# EAGLE design W964 (EAGLE 6.6.0)
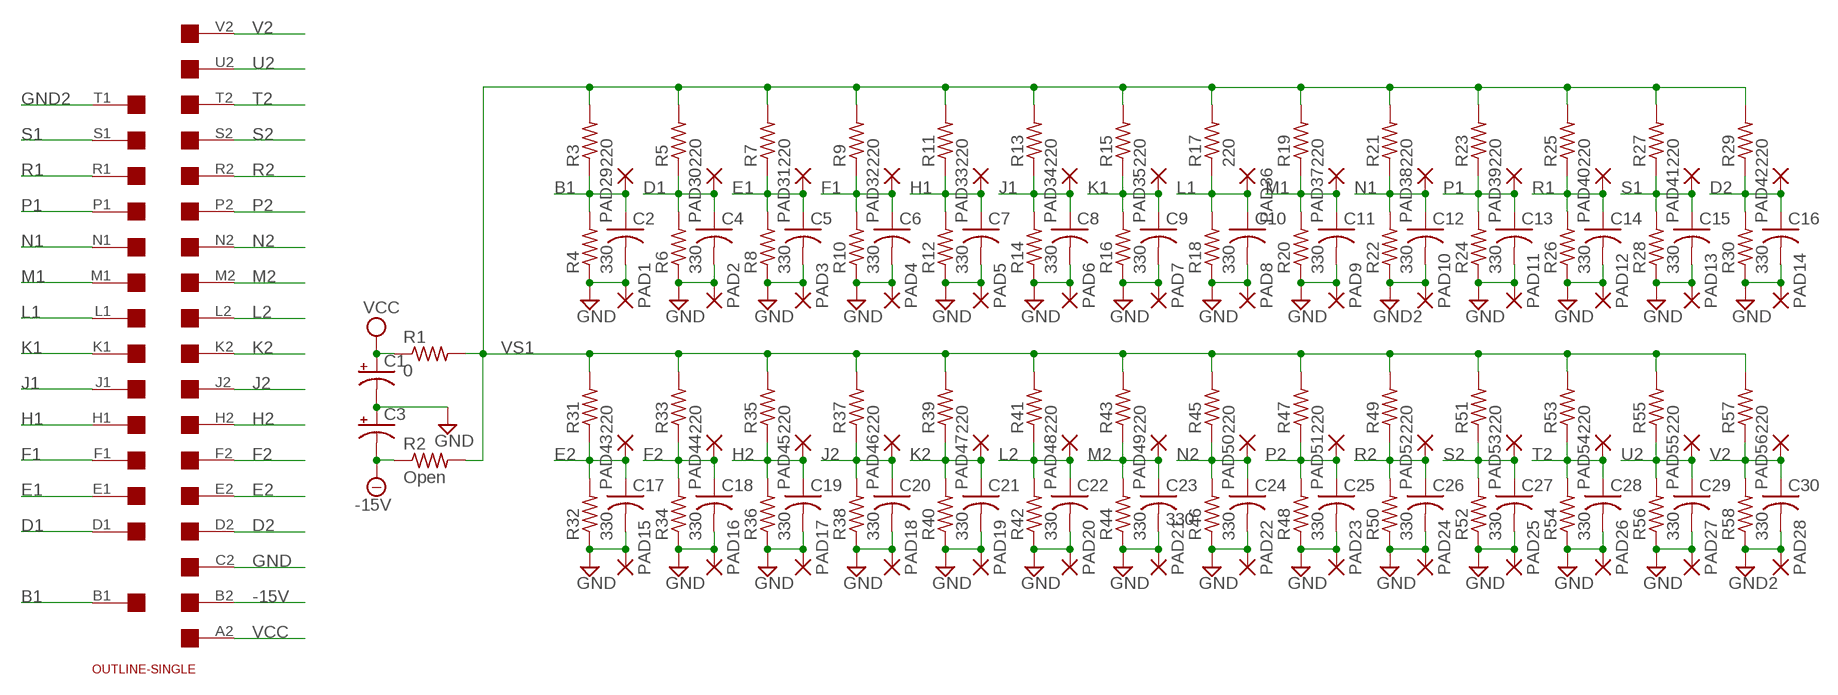
[diagram p0: schematic, sheet 1]

## Parts
C1  CPOL-USE22-6AXIAL  [E22-6]
C2  C-US050-025X075  [C050-025X075]
C3  CPOL-USE22-6AXIAL  [E22-6]
C4  C-US050-025X075  [C050-025X075]
C5  C-US050-025X075  [C050-025X075]
C6  C-US050-025X075  [C050-025X075]
C7  C-US050-025X075  [C050-025X075]
C8  C-US050-025X075  [C050-025X075]
C9  C-US050-025X075  [C050-025X075]
C10  C-US050-025X075  [C050-025X075]
C11  C-US050-025X075  [C050-025X075]
C12  C-US050-025X075  [C050-025X075]
C13  C-US050-025X075  [C050-025X075]
C14  C-US050-025X075  [C050-025X075]
C15  C-US050-025X075  [C050-025X075]
C16  C-US050-025X075  [C050-025X075]
C17  C-US050-025X075  [C050-025X075]
C18  C-US050-025X075  [C050-025X075]
C19  C-US050-025X075  [C050-025X075]
C20  C-US050-025X075  [C050-025X075]
C21  C-US050-025X075  [C050-025X075]
C22  C-US050-025X075  [C050-025X075]
C23  330  C-US050-025X075  [C050-025X075]
C24  C-US050-025X075  [C050-025X075]
C25  C-US050-025X075  [C050-025X075]
C26  C-US050-025X075  [C050-025X075]
C27  C-US050-025X075  [C050-025X075]
C28  C-US050-025X075  [C050-025X075]
C29  C-US050-025X075  [C050-025X075]
C30  C-US050-025X075  [C050-025X075]
PAD1  1,6/0,9  [1,6/0,9]
PAD2  1,6/0,9  [1,6/0,9]
PAD3  1,6/0,9  [1,6/0,9]
PAD4  1,6/0,9  [1,6/0,9]
PAD5  1,6/0,9  [1,6/0,9]
PAD6  1,6/0,9  [1,6/0,9]
PAD7  1,6/0,9  [1,6/0,9]
PAD8  1,6/0,9  [1,6/0,9]
PAD9  1,6/0,9  [1,6/0,9]
PAD10  1,6/0,9  [1,6/0,9]
PAD11  1,6/0,9  [1,6/0,9]
PAD12  1,6/0,9  [1,6/0,9]
PAD13  1,6/0,9  [1,6/0,9]
PAD14  1,6/0,9  [1,6/0,9]
PAD15  1,6/0,9  [1,6/0,9]
PAD16  1,6/0,9  [1,6/0,9]
PAD17  1,6/0,9  [1,6/0,9]
PAD18  1,6/0,9  [1,6/0,9]
PAD19  1,6/0,9  [1,6/0,9]
PAD20  1,6/0,9  [1,6/0,9]
PAD21  1,6/0,9  [1,6/0,9]
PAD22  1,6/0,9  [1,6/0,9]
PAD23  1,6/0,9  [1,6/0,9]
PAD24  1,6/0,9  [1,6/0,9]
PAD25  1,6/0,9  [1,6/0,9]
PAD26  1,6/0,9  [1,6/0,9]
PAD27  1,6/0,9  [1,6/0,9]
PAD28  1,6/0,9  [1,6/0,9]
PAD29  1,6/0,9  [1,6/0,9]
PAD30  1,6/0,9  [1,6/0,9]
PAD31  1,6/0,9  [1,6/0,9]
PAD32  1,6/0,9  [1,6/0,9]
PAD33  1,6/0,9  [1,6/0,9]
PAD34  1,6/0,9  [1,6/0,9]
PAD35  1,6/0,9  [1,6/0,9]
PAD36  1,6/0,9  [1,6/0,9]
PAD37  1,6/0,9  [1,6/0,9]
PAD38  1,6/0,9  [1,6/0,9]
PAD39  1,6/0,9  [1,6/0,9]
PAD40  1,6/0,9  [1,6/0,9]
PAD41  1,6/0,9  [1,6/0,9]
PAD42  1,6/0,9  [1,6/0,9]
PAD43  1,6/0,9  [1,6/0,9]
PAD44  1,6/0,9  [1,6/0,9]
PAD45  1,6/0,9  [1,6/0,9]
PAD46  1,6/0,9  [1,6/0,9]
PAD47  1,6/0,9  [1,6/0,9]
PAD48  1,6/0,9  [1,6/0,9]
PAD49  1,6/0,9  [1,6/0,9]
PAD50  1,6/0,9  [1,6/0,9]
PAD51  1,6/0,9  [1,6/0,9]
PAD52  1,6/0,9  [1,6/0,9]
PAD53  1,6/0,9  [1,6/0,9]
PAD54  1,6/0,9  [1,6/0,9]
PAD55  1,6/0,9  [1,6/0,9]
PAD56  1,6/0,9  [1,6/0,9]
R1  0  R-US_0207/10  [0207/10]
R2  Open  R-US_0207/10  [0207/10]
R3  220  R-US_0207/10  [0207/10]
R4  330  R-US_0207/10  [0207/10]
R5  220  R-US_0207/10  [0207/10]
R6  330  R-US_0207/10  [0207/10]
R7  220  R-US_0207/10  [0207/10]
R8  330  R-US_0207/10  [0207/10]
R9  220  R-US_0207/10  [0207/10]
R10  330  R-US_0207/10  [0207/10]
R11  220  R-US_0207/10  [0207/10]
R12  330  R-US_0207/10  [0207/10]
R13  220  R-US_0207/10  [0207/10]
R14  330  R-US_0207/10  [0207/10]
R15  220  R-US_0207/10  [0207/10]
R16  330  R-US_0207/10  [0207/10]
R17  220  R-US_0207/10  [0207/10]
R18  330  R-US_0207/10  [0207/10]
R19  220  R-US_0207/10  [0207/10]
R20  330  R-US_0207/10  [0207/10]
R21  220  R-US_0207/10  [0207/10]
R22  330  R-US_0207/10  [0207/10]
R23  220  R-US_0207/10  [0207/10]
R24  330  R-US_0207/10  [0207/10]
R25  220  R-US_0207/10  [0207/10]
R26  330  R-US_0207/10  [0207/10]
R27  220  R-US_0207/10  [0207/10]
R28  330  R-US_0207/10  [0207/10]
R29  220  R-US_0207/10  [0207/10]
R30  330  R-US_0207/10  [0207/10]
R31  220  R-US_0207/10  [0207/10]
R32  330  R-US_0207/10  [0207/10]
R33  220  R-US_0207/10  [0207/10]
R34  330  R-US_0207/10  [0207/10]
R35  220  R-US_0207/10  [0207/10]
R36  330  R-US_0207/10  [0207/10]
R37  220  R-US_0207/10  [0207/10]
R38  330  R-US_0207/10  [0207/10]
R39  220  R-US_0207/10  [0207/10]
R40  330  R-US_0207/10  [0207/10]
R41  220  R-US_0207/10  [0207/10]
R42  330  R-US_0207/10  [0207/10]
R43  220  R-US_0207/10  [0207/10]
R44  330  R-US_0207/10  [0207/10]
R45  220  R-US_0207/10  [0207/10]
R46  330  R-US_0207/10  [0207/10]
R47  220  R-US_0207/10  [0207/10]
R48  330  R-US_0207/10  [0207/10]
R49  220  R-US_0207/10  [0207/10]
R50  330  R-US_0207/10  [0207/10]
R51  220  R-US_0207/10  [0207/10]
R52  330  R-US_0207/10  [0207/10]
R53  220  R-US_0207/10  [0207/10]
R54  330  R-US_0207/10  [0207/10]
R55  220  R-US_0207/10  [0207/10]
R56  330  R-US_0207/10  [0207/10]
R57  220  R-US_0207/10  [0207/10]
R58  330  R-US_0207/10  [0207/10]
U$1  EDGE-2CONNECTOR  [EDGE-CON2]
U$2  OUTLINE-SINGLE  [SINGLE]

## Nets
-15V [power]: C3.- R2.1 U$1.B2
B1: C2.1 PAD29.1(P) R3.1 R4.2 U$1.B1
D1: C4.1 PAD30.1(P) R5.1 R6.2 U$1.D1
D2: C16.1 PAD42.1(P) R29.1 R30.2 U$1.D2
E1: C5.1 PAD31.1(P) R7.1 R8.2 U$1.E1
E2: C17.1 PAD43.1(P) R31.1 R32.2 U$1.E2
F1: C6.1 PAD32.1(P) R9.1 R10.2 U$1.F1
F2: C18.1 PAD44.1(P) R33.1 R34.2 U$1.F2
GND [power]: C1.- C2.2 C3.+ C4.2 C5.2 C6.2 C7.2 C8.2 C9.2 C10.2 C11.2 C13.2 C14.2 C15.2 C16.2 C17.2 C18.2 C19.2 C20.2 C21.2 C22.2 C23.2 C24.2 C25.2 C26.2 C27.2 C28.2 C29.2 PAD1.1(P) PAD2.1(P) PAD3.1(P) PAD4.1(P) PAD5.1(P) PAD6.1(P) PAD7.1(P) PAD8.1(P) PAD9.1(P) PAD11.1(P) PAD12.1(P) PAD13.1(P) PAD14.1(P) PAD15.1(P) PAD16.1(P) PAD17.1(P) PAD18.1(P) PAD19.1(P) PAD20.1(P) PAD21.1(P) PAD22.1(P) PAD23.1(P) PAD24.1(P) PAD25.1(P) PAD26.1(P) PAD27.1(P) R4.1 R6.1 R8.1 R10.1 R12.1 R14.1 R16.1 R18.1 R20.1 R24.1 R26.1 R28.1 R30.1 R32.1 R34.1 R36.1 R38.1 R40.1 R42.1 R44.1 R46.1 R48.1 R50.1 R52.1 R54.1 R56.1 U$1.C2
GND2 [power]: C12.2 C30.2 PAD10.1(P) PAD28.1(P) R22.1 R58.1 U$1.T1
H1: C7.1 PAD33.1(P) R11.1 R12.2 U$1.H1
H2: C19.1 PAD45.1(P) R35.1 R36.2 U$1.H2
J1: C8.1 PAD34.1(P) R13.1 R14.2 U$1.J1
J2: C20.1 PAD46.1(P) R37.1 R38.2 U$1.J2
K1: C9.1 PAD35.1(P) R15.1 R16.2 U$1.K1
K2: C21.1 PAD47.1(P) R39.1 R40.2 U$1.K2
L1: C10.1 PAD36.1(P) R17.1 R18.2 U$1.L1
L2: C22.1 PAD48.1(P) R41.1 R42.2 U$1.L2
M1: C11.1 PAD37.1(P) R19.1 R20.2 U$1.M1
M2: C23.1 PAD49.1(P) R43.1 R44.2 U$1.M2
N1: C12.1 PAD38.1(P) R21.1 R22.2 U$1.N1
N2: C24.1 PAD50.1(P) R45.1 R46.2 U$1.N2
P1: C13.1 PAD39.1(P) R23.1 R24.2 U$1.P1
P2: C25.1 PAD51.1(P) R47.1 R48.2 U$1.P2
R1: C14.1 PAD40.1(P) R25.1 R26.2 U$1.R1
R2: C26.1 PAD52.1(P) R49.1 R50.2 U$1.R2
S1: C15.1 PAD41.1(P) R27.1 R28.2 U$1.S1
S2: C27.1 PAD53.1(P) R51.1 R52.2 U$1.S2
T2: C28.1 PAD54.1(P) R53.1 R54.2 U$1.T2
U2: C29.1 PAD55.1(P) R55.1 R56.2 U$1.U2
V2: C30.1 PAD56.1(P) R57.1 R58.2 U$1.V2
VCC [power]: C1.+ R1.1 U$1.A2
VS1: R1.2 R2.2 R3.2 R5.2 R7.2 R9.2 R11.2 R13.2 R15.2 R17.2 R19.2 R21.2 R23.2 R25.2 R27.2 R29.2 R31.2 R33.2 R35.2 R37.2 R39.2 R41.2 R43.2 R45.2 R47.2 R49.2 R51.2 R53.2 R55.2 R57.2
Unconnected: U$1.A1 U$1.C1 U$1.U1 U$1.V1

## Library data of the parts
C1 C3 = rcl:CPOL-US: POLARIZED CAPACITOR, American symbol
C2 C4-C30 = rcl:C-US: CAPACITOR, American symbol
PAD1-PAD56 = wirepad:1,6/0,9: THROUGH-HOLE PAD
R1-R58 = rcl:R-US_: RESISTOR, American symbol
U$1 = dec-con:EDGE-2: Double-Sided DEC edge connector.
U$2 = dec-con:OUTLINE-*: Board outlines for DEC boards.

## Net classes
1 power: width 0.508 mm

## Board
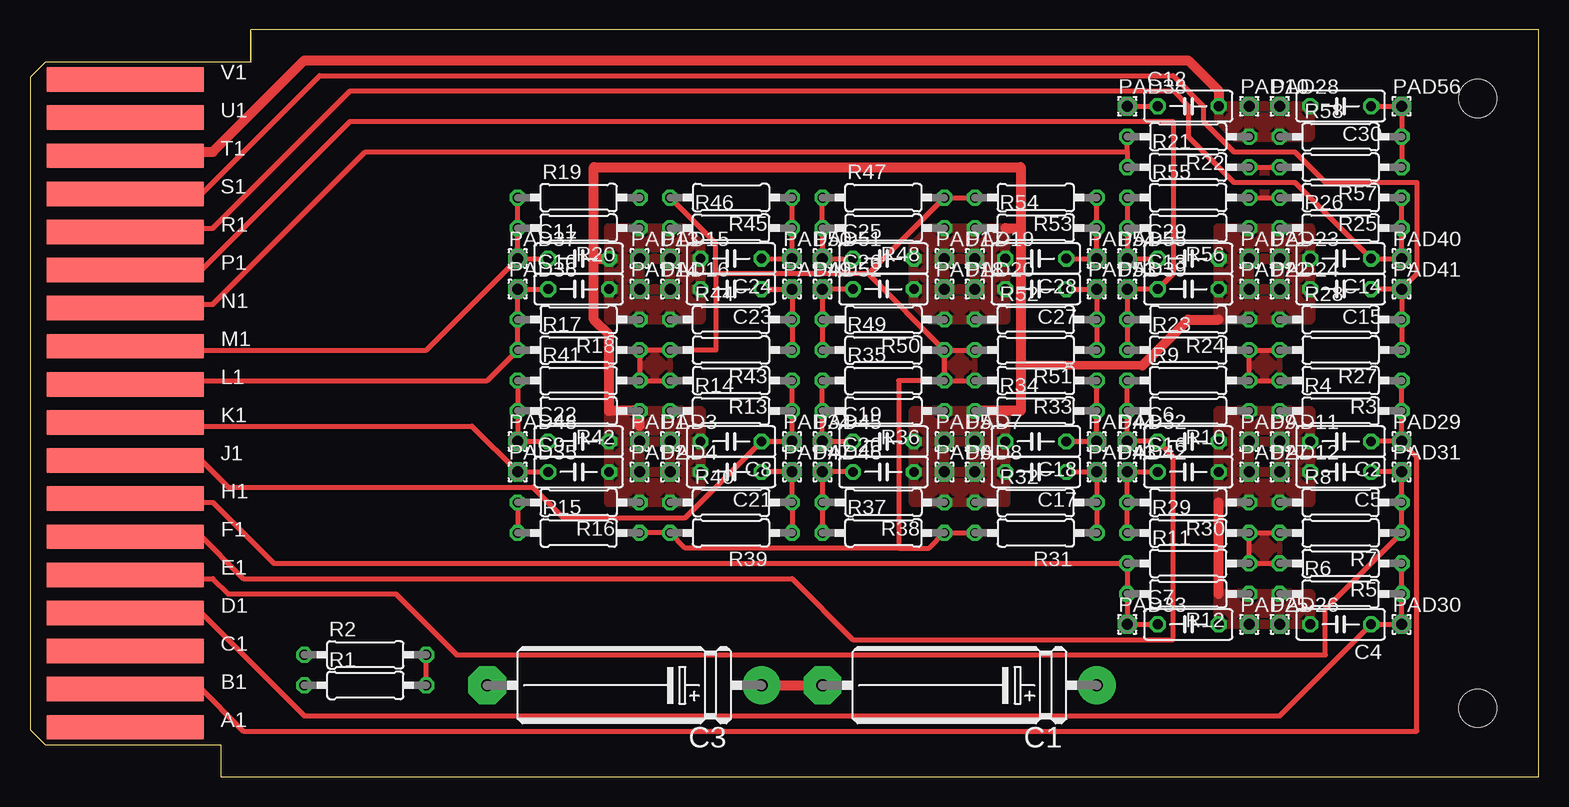
[diagram p1: board, top side]
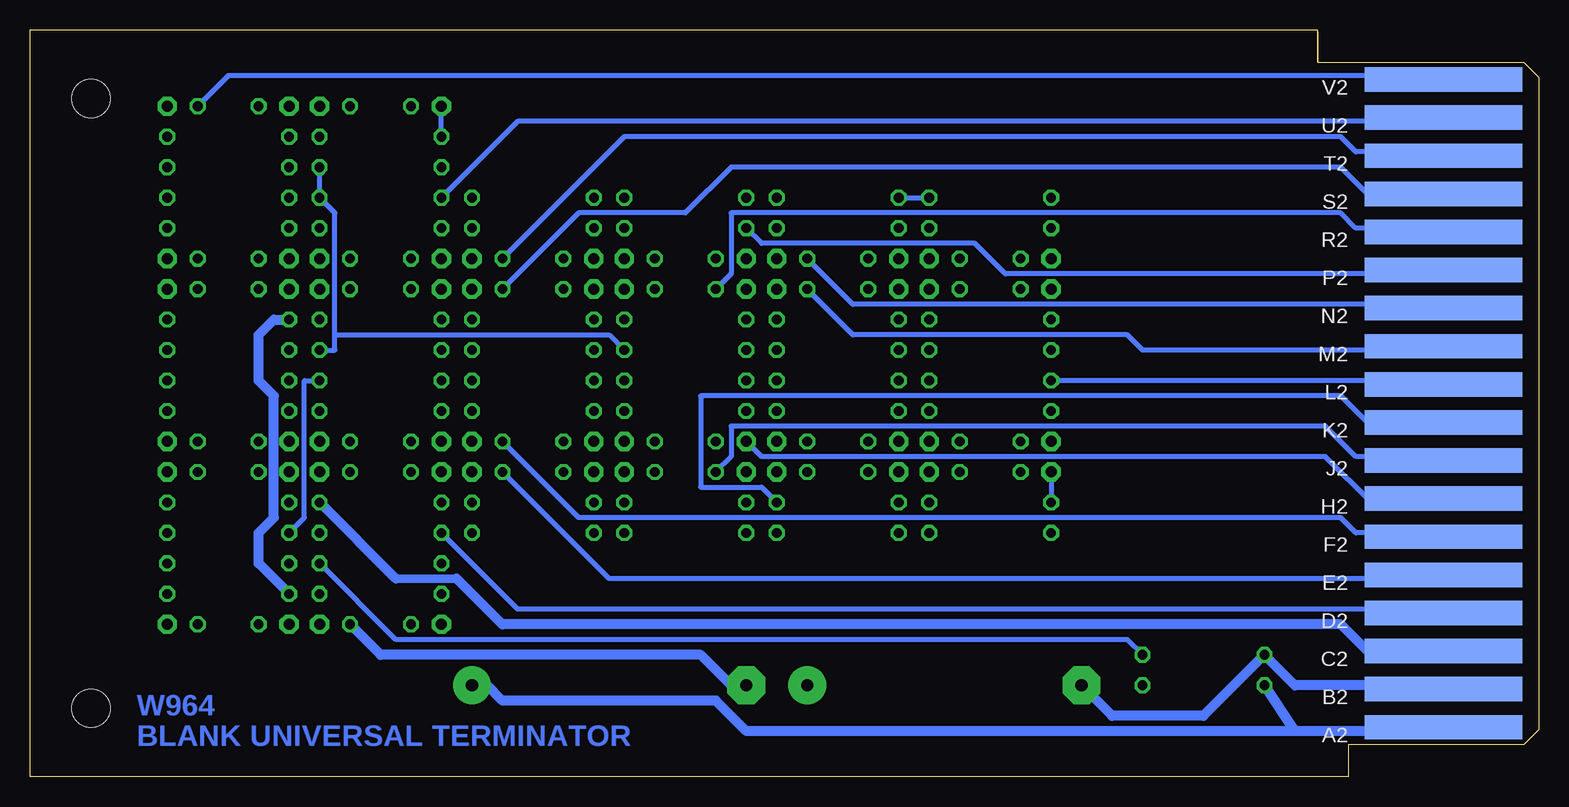
[diagram p2: board, bottom side, seen from below]

Size 125.73 x 62.23 mm. Coordinates in mm from the lower left corner, seen from the top.
Copper layers (1+16): Top 0.035mm / dielectric 1.5mm / Bottom 0.035mm
Design rules "16mils": minimum track width 16mil, minimum drill 32mil, track to track 15mil, track to pad 10mil, pad to pad 10mil, via to via 10mil, smd to smd 10mil, copper to edge 13mil, drill to drill 10mil, minimum pad ring 10mil, minimum via ring 8mil, stop-mask expansion 0mil, vias tented up to drill 0mil, thermal gap 10mil

### Footprints (pad centres in the part's own frame; a part is rotated, then mirrored left to right if it is on the bottom)
E22-6 = drill 1.016 pad 3.15: + -11.43,0 | drill 1.016 pad 3.15 octagon: - 11.43,0
C050-025X075 = drill 0.813 octagon: 1 -2.54,0; 2 2.54,0
1,6/0,9 = drill 0.914 pad 1.6 octagon: 1 0,0
0207/10 = drill 0.813 octagon: 1 -5.08,0; 2 5.08,0
EDGE-CON2 = smd 13.106 x 2.032: A1 7.938,4.128; B1 7.938,7.303; C1 7.938,10.477; D1 7.938,13.652; E1 7.938,16.828; F1 7.938,20.003; H1 7.938,23.177; J1 7.938,26.352; K1 7.938,29.527; L1 7.938,32.703; M1 7.938,35.877; N1 7.938,39.053; P1 7.938,42.227; R1 7.938,45.403; S1 7.938,48.578; T1 7.938,51.752; U1 7.938,54.928; V1 7.938,58.102 | smd 13.106 x 2.032 bottom: A2 7.938,4.128; B2 7.938,7.303; C2 7.938,10.477; D2 7.938,13.652; E2 7.938,16.828; F2 7.938,20.003; H2 7.938,23.177; J2 7.938,26.352; K2 7.938,29.527; L2 7.938,32.703; M2 7.938,35.877; N2 7.938,39.053; P2 7.938,42.227; R2 7.938,45.403; S2 7.938,48.578; T2 7.938,51.752; U2 7.938,54.928; V2 7.938,58.102
SINGLE = hole 3.175: 120.65,56.515; 120.65,5.715

### Placement (x,y rotation side)
C1  77.47,7.62 180 top
C2  109.22,27.94 180 top
C3  49.53,7.62 180 top
C4  109.22,12.7 180 top
C5  109.22,25.4 180 top
C6  96.52,27.94 0 top
C7  96.52,12.7 0 top
C8  58.42,27.94 180 top
C9  45.72,25.4 0 top
C10  45.72,40.64 0 top
C11  45.72,43.18 0 top
C12  96.52,55.88 0 top
C13  96.52,40.64 0 top
C14  109.22,43.18 180 top
C15  109.22,40.64 180 top
C16  96.52,25.4 0 top
C17  83.82,25.4 180 top
C18  83.82,27.94 180 top
C19  71.12,27.94 0 top
C20  71.12,25.4 0 top
C21  58.42,25.4 180 top
C22  45.72,27.94 0 top
C23  58.42,40.64 180 top
C24  58.42,43.18 180 top
C25  71.12,43.18 0 top
C26  71.12,40.64 0 top
C27  83.82,40.64 180 top
C28  83.82,43.18 180 top
C29  96.52,43.18 0 top
C30  109.22,55.88 180 top
PAD1  50.8,27.94 0 top
PAD2  50.8,25.4 0 top
PAD3  53.34,27.94 0 top
PAD4  53.34,25.4 0 top
PAD5  76.2,27.94 0 top
PAD6  76.2,25.4 0 top
PAD7  78.74,27.94 0 top
PAD8  78.74,25.4 0 top
PAD9  101.6,27.94 0 top
PAD10  101.6,55.88 0 top
PAD11  104.14,27.94 0 top
PAD12  104.14,25.4 0 top
PAD13  50.8,43.18 0 top
PAD14  50.8,40.64 0 top
PAD15  53.34,43.18 0 top
PAD16  53.34,40.64 0 top
PAD17  76.2,43.18 0 top
PAD18  76.2,40.64 0 top
PAD19  78.74,43.18 0 top
PAD20  78.74,40.64 0 top
PAD21  101.6,43.18 0 top
PAD22  101.6,40.64 0 top
PAD23  104.14,43.18 0 top
PAD24  104.14,40.64 0 top
PAD25  101.6,12.7 0 top
PAD26  104.14,12.7 0 top
PAD27  101.6,25.4 0 top
PAD28  104.14,55.88 0 top
PAD29  114.3,27.94 0 top
PAD30  114.3,12.7 0 top
PAD31  114.3,25.4 0 top
PAD32  91.44,27.94 0 top
PAD33  91.44,12.7 0 top
PAD34  63.5,27.94 0 top
PAD35  40.64,25.4 0 top
PAD36  40.64,40.64 0 top
PAD37  40.64,43.18 0 top
PAD38  91.44,55.88 0 top
PAD39  91.44,40.64 0 top
PAD40  114.3,43.18 0 top
PAD41  114.3,40.64 0 top
PAD42  91.44,25.4 0 top
PAD43  88.9,25.4 0 top
PAD44  88.9,27.94 0 top
PAD45  66.04,27.94 0 top
PAD46  66.04,25.4 0 top
PAD47  63.5,25.4 0 top
PAD48  40.64,27.94 0 top
PAD49  63.5,40.64 0 top
PAD50  63.5,43.18 0 top
PAD51  66.04,43.18 0 top
PAD52  66.04,40.64 0 top
PAD53  88.9,40.64 0 top
PAD54  88.9,43.18 0 top
PAD55  91.44,43.18 0 top
PAD56  114.3,55.88 0 top
R1  27.94,7.62 0 top
R2  27.94,10.16 0 top
R3  109.22,33.02 180 top
R4  109.22,30.48 0 top
R5  109.22,17.78 180 top
R6  109.22,15.24 0 top
R7  109.22,20.32 180 top
R8  109.22,22.86 0 top
R9  96.52,33.02 0 top
R10  96.52,30.48 180 top
R11  96.52,17.78 0 top
R12  96.52,15.24 180 top
R13  58.42,33.02 180 top
R14  58.42,30.48 0 top
R15  45.72,20.32 0 top
R16  45.72,22.86 180 top
R17  45.72,35.56 0 top
R18  45.72,38.1 180 top
R19  45.72,48.26 0 top
R20  45.72,45.72 180 top
R21  96.52,50.8 0 top
R22  96.52,53.34 180 top
R23  96.52,35.56 0 top
R24  96.52,38.1 180 top
R25  109.22,48.26 180 top
R26  109.22,45.72 0 top
R27  109.22,35.56 180 top
R28  109.22,38.1 0 top
R29  96.52,20.32 0 top
R30  96.52,22.86 180 top
R31  83.82,20.32 180 top
R32  83.82,22.86 0 top
R33  83.82,33.02 180 top
R34  83.82,30.48 0 top
R35  71.12,33.02 0 top
R36  71.12,30.48 180 top
R37  71.12,20.32 0 top
R38  71.12,22.86 180 top
R39  58.42,20.32 180 top
R40  58.42,22.86 0 top
R41  45.72,33.02 0 top
R42  45.72,30.48 180 top
R43  58.42,35.56 180 top
R44  58.42,38.1 0 top
R45  58.42,48.26 180 top
R46  58.42,45.72 0 top
R47  71.12,48.26 0 top
R48  71.12,45.72 180 top
R49  71.12,35.56 0 top
R50  71.12,38.1 180 top
R51  83.82,35.56 180 top
R52  83.82,38.1 0 top
R53  83.82,48.26 180 top
R54  83.82,45.72 0 top
R55  96.52,48.26 0 top
R56  96.52,45.72 180 top
R57  109.22,50.8 180 top
R58  109.22,53.34 0 top
U$1  0,0 0 top
U$2  0,0 0 top

### Tracks (layer width: path | path; a pad name or v marks a point on that pad's centre or on a via)
-15V
  Bottom 0.813: U$1.B2 13.97,7.62 20.32,7.62 R2.1 27.94,5.08 35.56,5.08 C3.-
B1
  Top 0.406: R3.1 R4.2 PAD29.1 | PAD29.1 C2.1 | PAD29.1 115.57,26.67 115.57,3.81 17.78,3.81 13.97,7.62 12.7,7.62 U$1.B1
D1
  Top 0.406: R5.1 R6.2 PAD30.1 C4.1 104.14,5.08 22.86,5.08 13.97,13.97 12.7,13.97 U$1.D1
D2
  Top 0.406: R29.1 R30.2 PAD42.1 C16.1
  Bottom 0.406: R29.1 85.09,13.97 13.97,13.97 U$1.D2
E1
  Top 0.406: C5.1 PAD31.1 R8.2 R7.1 107.95,13.97 107.95,10.16 35.56,10.16 30.48,15.24 16.51,15.24 15.24,16.51 13.97,16.51 U$1.E1
E2
  Top 0.406: R31.1 R32.2 PAD43.1 C17.1
  Bottom 0.406: C17.1 77.47,16.51 13.97,16.51 U$1.E2
F1
  Top 0.406: R9.1 R10.2 PAD32.1 C6.1 95.25,26.67 95.25,11.43 68.58,11.43 63.5,16.51 17.78,16.51 13.97,20.32 12.7,20.32 U$1.F1
F2
  Top 0.406: R33.1 R34.2 PAD44.1 C18.1
  Bottom 0.406: C18.1 80.01,21.59 16.51,21.59 15.24,20.32 13.97,20.32 U$1.F2
GND
  Top 0.711: 82.55,34.29 92.71,34.29
  Top 0.813: 99.06,15.24 99.06,22.86 | C3.+ C1.- | 46.99,43.18 46.99,38.1 48.26,36.83 48.26,30.48 R42.1 50.8,29.21 | 46.99,43.18 46.99,50.8 82.55,50.8 82.55,45.72 | 46.99,43.18 C11.2 | 82.55,45.72 82.55,34.29 82.55,30.48 R34.1 | 92.71,34.29 96.52,38.1 99.06,38.1 | 81.28,45.72 82.55,45.72
  Bottom 0.711: 90.17,16.51 95.25,16.51
  Bottom 0.813: R6.1 106.68,17.78 106.68,20.32 105.41,21.59 105.41,31.75 106.68,33.02 106.68,36.83 105.41,38.1 R28.1 | C7.2 96.52,10.16 69.85,10.16 67.31,7.62 C1.- | 90.17,16.51 86.36,12.7 16.51,12.7 13.97,10.16 U$1.C2 | 95.25,16.51 R30.1
  pour Top: 48.26,30.48 55.88,30.48 55.88,22.86 48.26,22.86
  pour Top: 48.26,45.72 55.88,45.72 55.88,38.1 48.26,38.1
  pour Top: 73.66,45.72 81.28,45.72 81.28,38.1 73.66,38.1
  pour Top: 73.66,30.48 81.28,30.48 81.28,22.86 73.66,22.86
  pour Top: 99.06,30.48 106.68,30.48 106.68,22.86 99.06,22.86
  pour Top: 99.06,45.72 106.68,45.72 106.68,38.1 99.06,38.1
  pour Top: 99.06,12.7 99.06,15.24 106.68,15.24 106.68,12.7
GND2
  Top 0.813: C12.2 99.06,57.15 96.52,59.69 22.86,59.69 15.24,52.07 13.97,52.07 U$1.T1
  pour Top: 99.06,53.34 106.68,53.34 106.68,55.88 99.06,55.88
H1
  Top 0.406: C7.1 PAD33.1 R12.2 R11.1 20.32,17.78 15.24,22.86 13.97,22.86 U$1.H1
H2
  Top 0.406: R35.1 R36.2 PAD45.1 C19.1
  Bottom 0.406: PAD45.1 64.77,26.67 17.78,26.67 13.97,22.86 U$1.H2
J1
  Top 0.406: R13.1 R14.2 PAD34.1 C8.1 54.61,21.59 44.45,21.59 41.91,24.13 16.51,24.13 13.97,26.67 12.7,26.67 U$1.J1
J2
  Top 0.406: R37.1 R38.2 PAD46.1 C20.1
  Bottom 0.406: C20.1 67.31,26.67 67.31,29.21 17.78,29.21 15.24,26.67 13.97,26.67 U$1.J2
K1
  Top 0.406: R16.2 R15.1 | C9.1 PAD35.1 36.83,29.21 13.97,29.21 U$1.K1
  Bottom 0.406: PAD35.1 R16.2
K2
  Top 0.406: R39.1 R40.2 PAD47.1 C21.1
  Bottom 0.406: R40.2 64.77,24.13 69.85,24.13 69.85,31.75 16.51,31.75 13.97,29.21 12.7,29.21 U$1.K2
L1
  Top 0.406: C10.1 PAD36.1 R18.2 R17.1 38.1,33.02 13.97,33.02 U$1.L1
L2
  Top 0.406: R41.1 R42.2 PAD48.1 C22.1
  Bottom 0.406: R41.1 13.97,33.02 U$1.L2
M1
  Top 0.406: R19.1 R20.2 PAD37.1 | PAD37.1 C11.1 | PAD37.1 33.02,35.56 12.7,35.56 U$1.M1
M2
  Top 0.406: R43.1 R44.2 PAD49.1 C23.1
  Bottom 0.406: C23.1 57.15,36.83 34.29,36.83 33.02,35.56 13.97,35.56 U$1.M2
N1
  Top 0.406: 91.44,52.07 R22.2 | 91.44,52.07 R21.1 | PAD38.1 C12.1 | 91.44,52.07 27.94,52.07 15.24,39.37 13.97,39.37 U$1.N1
  Bottom 0.406: R22.2 PAD38.1
N2
  Top 0.406: R45.1 R46.2 PAD50.1 C24.1
  Bottom 0.406: C24.1 57.15,39.37 13.97,39.37 U$1.N2
P1
  Top 0.406: R23.1 R24.2 PAD39.1 C13.1 95.25,41.91 95.25,54.61 26.67,54.61 13.97,41.91 12.7,41.91 U$1.P1
P2
  Top 0.406: R47.1 R48.2 PAD51.1 C25.1
  Bottom 0.406: R48.2 64.77,44.45 46.99,44.45 44.45,41.91 13.97,41.91 U$1.P2
R1
  Top 0.406: R25.1 R26.2 PAD40.1 C14.1 105.41,49.53 100.33,49.53 96.52,53.34 96.52,55.88 95.25,57.15 26.67,57.15 15.24,45.72 13.97,45.72 U$1.R1
R2
  Top 0.406: R49.1 R50.2 PAD52.1 C26.1
  Bottom 0.406: C26.1 67.31,41.91 67.31,46.99 16.51,46.99 15.24,45.72 13.97,45.72 U$1.R2
S1
  Top 0.406: R27.1 R28.2 PAD41.1 | PAD41.1 C15.1 | PAD41.1 115.57,41.91 115.57,49.53 107.95,49.53 105.41,52.07 100.33,52.07 97.79,54.61 97.79,55.88 95.25,58.42 24.13,58.42 13.97,48.26 U$1.S1
S2
  Top 0.406: R51.1 R52.2 PAD53.1 C27.1
  Bottom 0.406: C27.1 80.01,46.99 71.12,46.99 67.31,50.8 16.51,50.8 13.97,48.26 12.7,48.26 U$1.S2
T2
  Top 0.406: R53.1 R54.2 PAD54.1 C28.1
  Bottom 0.406: C28.1 76.2,53.34 16.51,53.34 15.24,52.07 13.97,52.07 U$1.T2
U2
  Top 0.406: R55.1 R56.2 PAD55.1 C29.1
  Bottom 0.406: R55.1 85.09,54.61 13.97,54.61 U$1.U2
V2
  Top 0.406: R57.1 R58.2 PAD56.1 C30.1
  Bottom 0.406: C30.1 109.22,58.42 13.97,58.42 U$1.V2
VCC
  Bottom 0.813: 20.32,3.81 R1.1 | 20.32,3.81 13.97,3.81 U$1.A2 | 20.32,3.81 66.04,3.81 68.58,6.35 86.36,6.35 87.63,7.62 C1.+
VS1
  Top 0.406: R1.2 R2.2 | R5.2 R11.2 R29.2 R7.2 | R15.2 R39.2 54.61,19.05 72.39,19.05 | R31.2 R37.2 74.93,19.05 72.39,19.05 | R55.2 R25.2 | R21.2 R57.2 | R3.2 R9.2 R23.2 R27.2 | R49.2 R35.2 | R35.2 R33.2 | R49.2 R51.2 | R53.2 R47.2 69.85,41.91 | R13.2 R41.2 R17.2 R43.2 57.15,35.56 57.15,41.91 | R45.2 57.15,44.45 57.15,41.91 | 69.85,41.91 57.15,41.91 | R49.2 69.85,41.91 | 72.39,19.05 72.39,33.02 R35.2
  Bottom 0.406: R2.2 34.29,11.43 95.25,11.43 R11.2 | R21.2 R55.2 100.33,46.99 100.33,36.83 | R45.2 R19.2 | 100.33,36.83 100.33,35.56 R23.2 | R7.2 102.87,21.59 102.87,33.02 R9.2 | R49.2 77.47,36.83 100.33,36.83
  pour Top: 50.8,35.56 53.34,35.56 53.34,33.02 50.8,33.02
  pour Top: 76.2,35.56 78.74,35.56 78.74,33.02 76.2,33.02
  pour Top: 101.6,35.56 104.14,35.56 104.14,33.02 101.6,33.02
  pour Top: 101.6,20.32 104.14,20.32 104.14,17.78 101.6,17.78
  pour Top: 101.6,50.8 104.14,50.8 104.14,48.26 101.6,48.26

### Text on the board
Bottom: W964 | BLANK UNIVERSAL TERMINATOR